# Altium schematic sheet OpenPLCv0.2.0_RTC.SchDoc
size 420 x 297 mm; PageSetup: Record=PageOptions|CenterHorizontal=True|CenterVertical=True|PrintScale=1.01|XCorrection=1.00|YCorrection=1.00|PrintKind=1|BorderSize=5000000|LeftOffset=0|BottomOffset=0|Orientation=2|PaperLength=1000|PaperWidth=1000|Scale=100|PaperSource=7|PrintQuality=-4|MediaType=1|DitherType=10|PaperKind=A3|PrintScaleMode=1; DocumentNumber: 6; SheetNumber: 6; SheetTotal: 22; SheetTitle: Real Time Clock
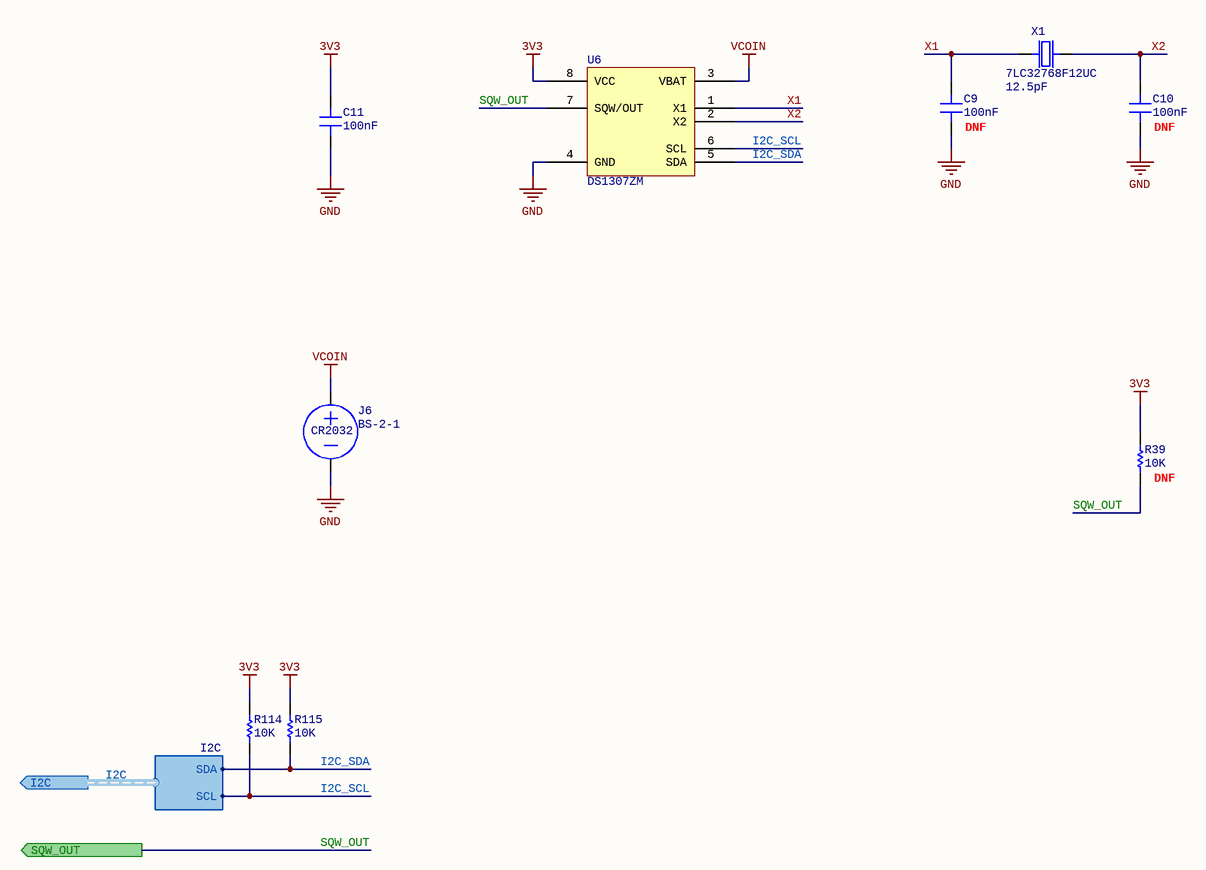
[diagram p0: OpenPLCv0.2.0_RTC.SchDoc]

## Parts
C9  Capacitance: 100nF  [SMD_CAP_0402(1005)_N]  (hidden comment: CC0402KRX5R9BB104)
C10  Capacitance: 100nF  [SMD_CAP_0402(1005)_N]  (hidden comment: CC0402KRX5R9BB104)
C11  Capacitance: 100nF  [SMD_CAP_0402(1005)_N]  (hidden comment: CC0402KRX5R6BB104)
J6  BS-2-1  [BS-2-1]
R39  Resistance: 10K  [SMD_RES_0402(1005)_N]  (hidden comment: RC0402FR-0710KL)
R114  Resistance: 10K  [SMD_RES_0402(1005)_N]  (hidden comment: RC0402FR-0710KL)
R115  Resistance: 10K  [SMD_RES_0402(1005)_N]  (hidden comment: RC0402FR-0710KL)
U6  DS1307ZM  [SOIC-8-3.9mm]
X1  7LC32768F12UC  Load capacitance: 12.5pF  [CRYSTAL_3215]

## Ports
I2C (out, harness I2C), SQW_OUT (out)

## Harnesses
I2C: SDA, SCL

## Nets
3V3: C11.2 R39.1 R114.2 R115.2 U6.8(VCC)
GND: C9.1 C10.1 C11.1 J6.2 U6.4(GND)
VCOIN: J6.1 U6.3(VBAT)
I2C_SCL: R114.1 U6.6(SCL) ; port I2C.SCL  [project net I2C.SCL]
I2C_SDA: R115.1 U6.5(SDA) ; port I2C.SDA  [project net I2C.SDA]
SQW_OUT: R39.2 U6.7(SQW/OUT) ; port SQW_OUT
X1: C9.2 U6.1(X1) X1.1
X2: C10.2 U6.2(X2) X1.2

## Buses and harness runs
harness I2C = port I2C

## Notes on the sheet
- (near C9) DNF
- (near C10) DNF
- (near R39) DNF
- FILE NAME
- PROJECT
- TITLE
- REV
- AUTHOR
- SIZE
- SHEET
- DATE
- OF
- A3
- (in symbol BS-2-1) CR2032

## Library data of the parts
C9 C10 = 100nF 0402 50V 10%: 100nF ±10% 50V X5R 0402 Multilayer Ceramic Capacitors MLCC - SMD/SMT RoHS; Package: 0402; Tolerance: 10%; Voltage Rating: 50V
C11 = 100nF 0402 10V 10%: 100nF ±10% 10V X5R 0402 Multilayer Ceramic Capacitors MLCC - SMD/SMT RoHS; Package: 0402; Tolerance: 10%; Voltage Rating: 10V
J6 = BS-2-1: DIP Battery Box/Battery Holders ROHS
R39 R114 R115 = 10K 0402 1% 1/16W: 10kΩ ±1% 1/16W ±100ppm/℃ 0402 Chip Resistor - Surface Mount RoHS; Package: 0402; Tolerance: 1%; Power Rating: 1/16W
U6 = DS1307ZM: HGSEMI SOP-8 Pre-ordered Chips RoHS
X1 = 7LC32768F12UC: 32.768KHz ±20ppm 12.5pF 70kΩ SMD-3215_2P SMD Crystal Resonators RoHS; Package: 3215